# EAGLE design 2te8x24V_DC_In_4_v02 (EAGLE 5.04)
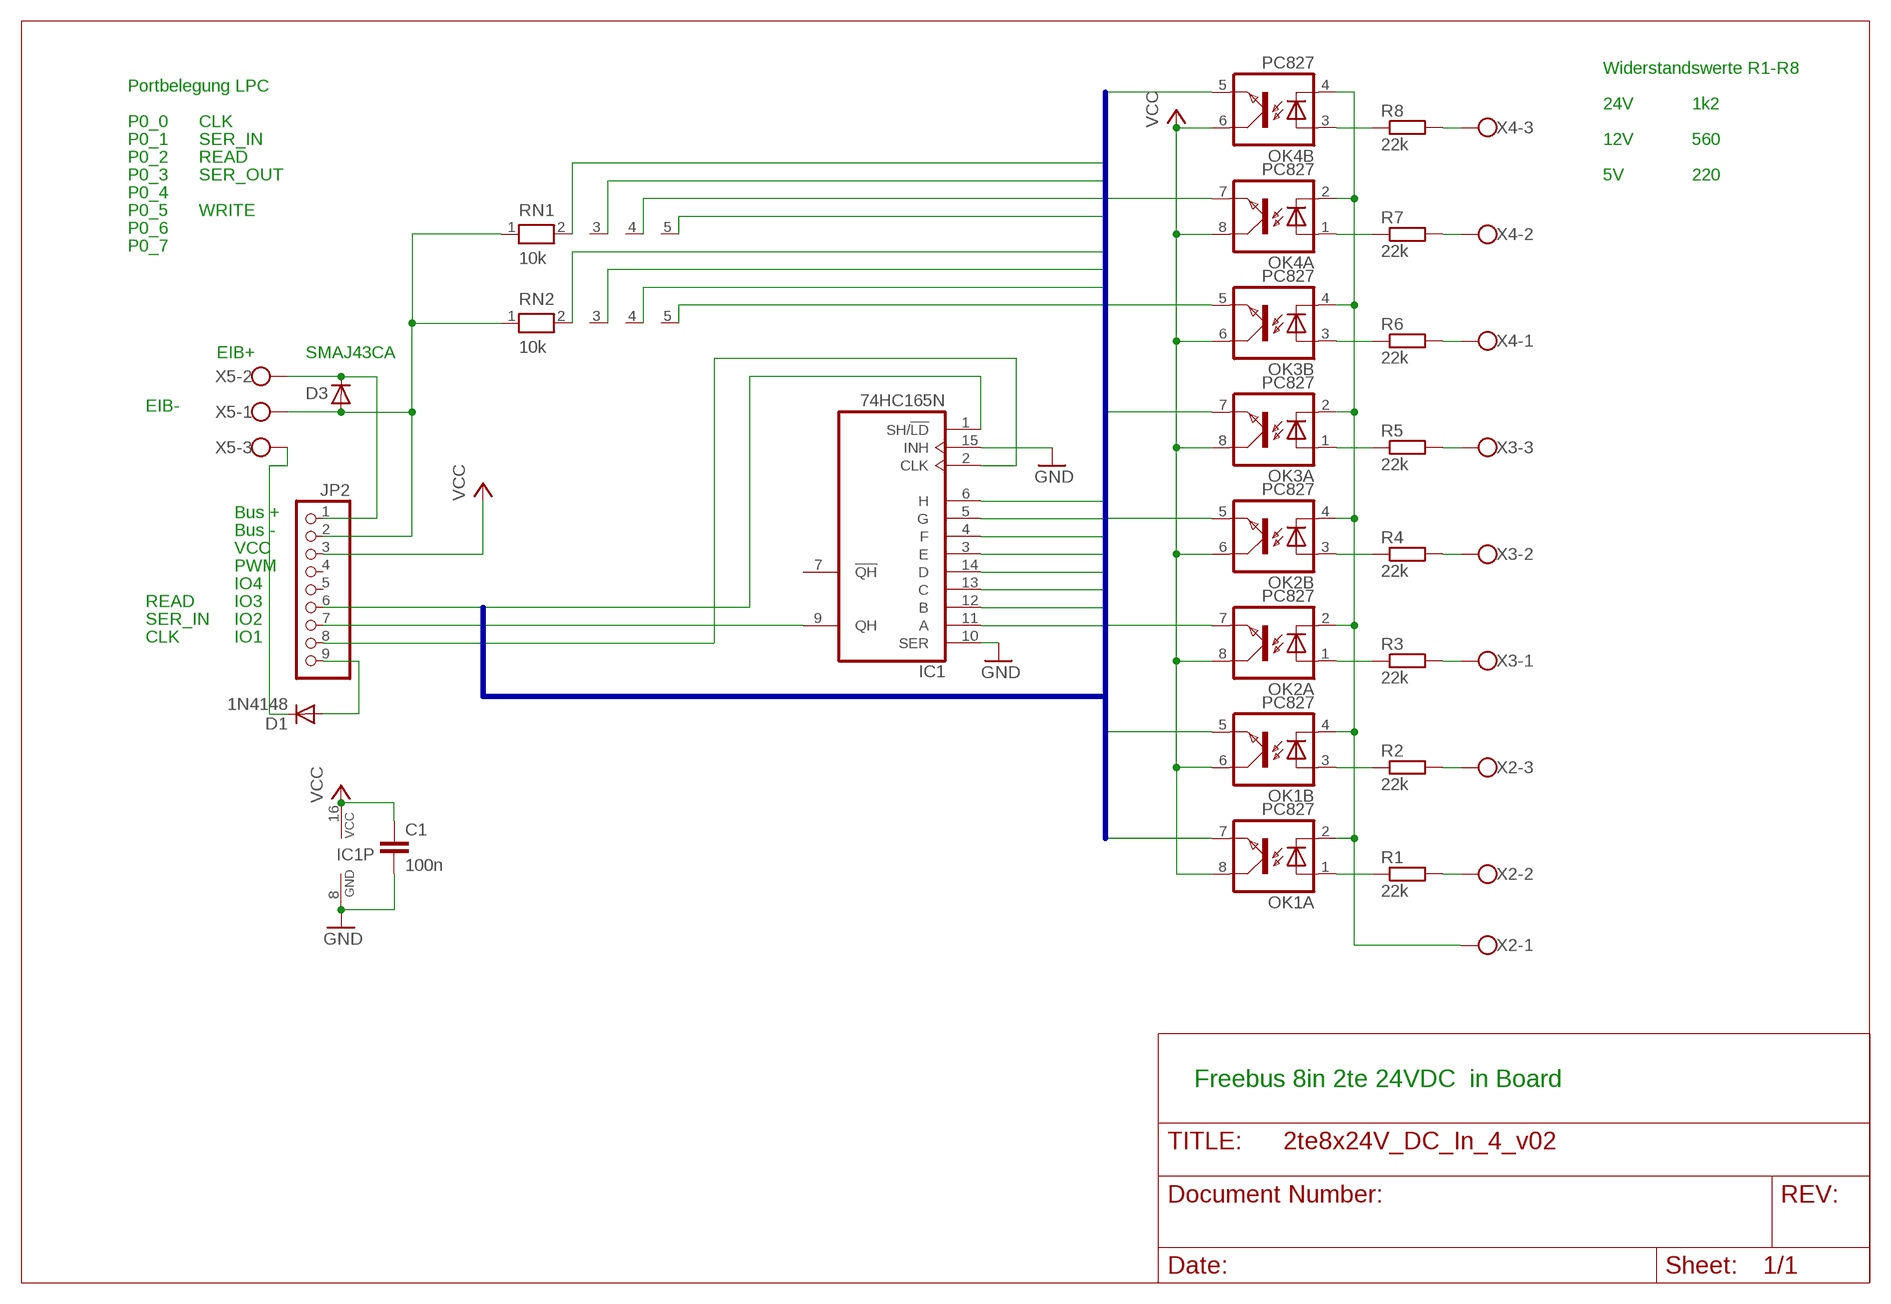
[diagram p0: schematic, sheet 1]

## Parts
C1  100n  C-EU050-024X044  [C050-024X044]
D1  1N4148  1N41481448V  [D-2.5]
D3  D-SMB  [SMB]
IC1  74HC165N  [DIL16]
JP2  PINHD-1X9  [1X09]
OK1  PC827  [DIL08]
OK2  PC827  [DIL08]
OK3  PC827  [DIL08]
OK4  PC827  [DIL08]
R1  22k  R-EU_0207/10  [0207/10]
R2  22k  R-EU_0207/10  [0207/10]
R3  22k  R-EU_0207/10  [0207/10]
R4  22k  R-EU_0207/10  [0207/10]
R5  22k  R-EU_0207/10  [0207/10]
R6  22k  R-EU_0207/10  [0207/10]
R7  22k  R-EU_0207/10  [0207/10]
R8  22k  R-EU_0207/10  [0207/10]
RN1  10k  RN04  [RN-5]
RN2  10k  RN04  [RN-5]
X2  W237-03P  [W237-133]
X3  W237-3E  [W237-3E]
X4  W237-3E  [W237-3E]
X5  W237-03P  [W237-133]

## Nets
E1: IC1.11(A) OK1.7(A:EMIT) RN2.2
E2: IC1.12(B) OK1.5(B:EMIT) RN2.3
E3: IC1.13(C) OK2.7(A:EMIT) RN2.4
E4: IC1.14(D) OK2.5(B:EMIT) RN2.5
E5: IC1.3(E) OK3.7(A:EMIT) RN1.5
E6: IC1.4(F) OK3.5(B:EMIT) RN1.4
E7: IC1.5(G) OK4.7(A:EMIT) RN1.3
E8: IC1.6(H) OK4.5(B:EMIT) RN1.2
EIB+: D3.1(C) JP2.1 X5.2
GND: C1.2 D3.2(A) IC1.8(GND) IC1.10(SER) IC1.15(INH) JP2.2 RN1.1 RN2.1 X5.1
GND24: OK1.2(A:C) OK1.4(B:C) OK2.2(A:C) OK2.4(B:C) OK3.2(A:C) OK3.4(B:C) OK4.2(A:C) OK4.4(B:C) X2.1
IO1: IC1.2(CLK) JP2.8
IO2: IC1.9(QH) JP2.7
IO3: IC1.1(SH/!LD) JP2.6
N$1: D1.C X5.3
N$2: OK1.1(A:A) R1.1
N$3: R1.2 X2.2
N$4: OK1.3(B:A) R2.1
N$5: R2.2 X2.3
N$6: OK2.1(A:A) R3.1
N$7: R3.2 X3.1
N$8: OK2.3(B:A) R4.1
N$9: R4.2 X3.2
N$10: OK3.1(A:A) R5.1
N$11: R5.2 X3.3
N$12: OK3.3(B:A) R6.1
N$13: R6.2 X4.1
N$14: OK4.1(A:A) R7.1
N$15: R7.2 X4.2
N$16: OK4.3(B:A) R8.1
N$17: R8.2 X4.3
N$18: D1.A JP2.9
VCC: C1.1 IC1.16(VCC) JP2.3 OK1.6(B:COL) OK1.8(A:COL) OK2.6(B:COL) OK2.8(A:COL) OK3.6(B:COL) OK3.8(A:COL) OK4.6(B:COL) OK4.8(A:COL)
Unconnected: IC1.7(!QH) JP2.4 JP2.5

## Buses
IO[1..8],E[1..8]

## Notes on the sheet
- Widerstandswerte R1-R8
- Portbelegung LPC
- 24V | 1k2
- P0_0 | CLK
- P0_1 | SER_IN | 12V | 560
- P0_2 | READ
- P0_3 | SER_OUT | 5V | 220
- P0_4
- P0_5 | WRITE
- P0_6
- P0_7
- EIB+ | SMAJ43CA
- EIB-
- Bus +
- Bus -
- VCC
- PWM
- IO4
- READ | IO3
- SER_IN | IO2
- CLK | IO1
- Freebus 8in 2te 24VDC  in Board

## Library data of the parts
C1 = rcl:C-EU: CAPACITOR, European symbol
D1 = diode:1N4148: DIODE high speed (Philips)
D3 = semicon-smd-ipc:D-: DIODE unfilled
IC1 = 74xx-eu:74*165: 8-bit parallel load SHIFT REGISTER
JP2 = pinhead:PINHD-1X9: PIN HEADER
OK1-OK4 = optocoupler:PC827: SHARP OPTO COUPLER
R1-R8 = rcl:R-EU_: RESISTOR, European symbol
RN1 RN2 = resistor-net:RN04: RESISTOR NETWORK
X2 X5 = con-wago-508:W237-03P: WAGO SREW CLAMP
X3 X4 = con-wago-508:W237-3E: WAGO SREW CLAMP

## Board
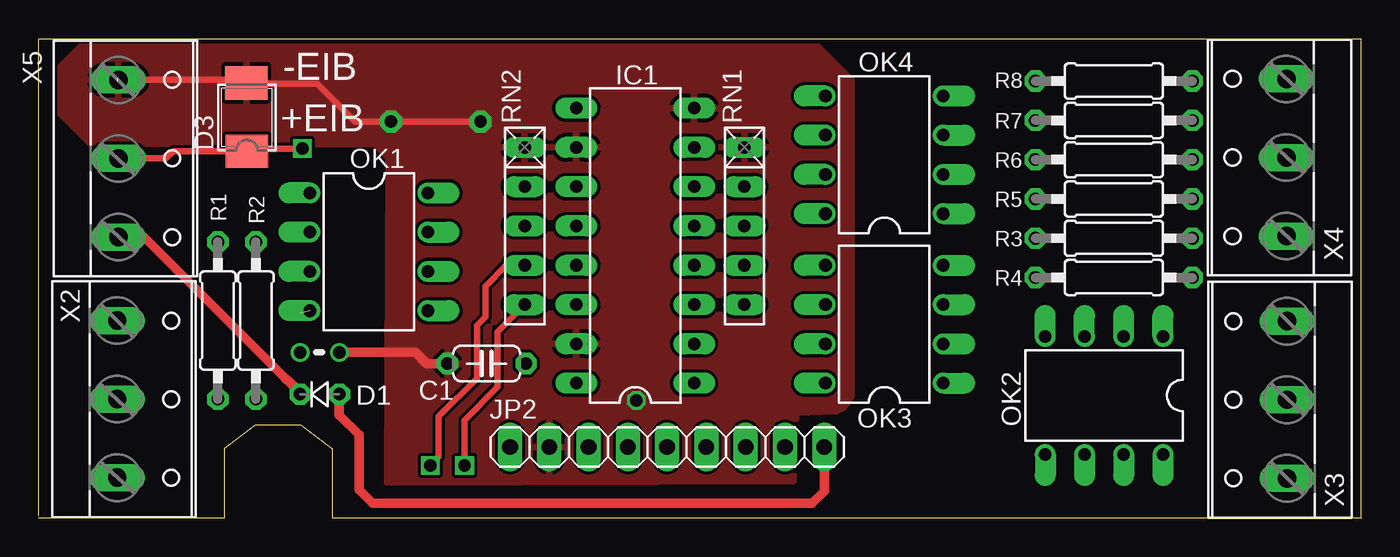
[diagram p1: board, top side]
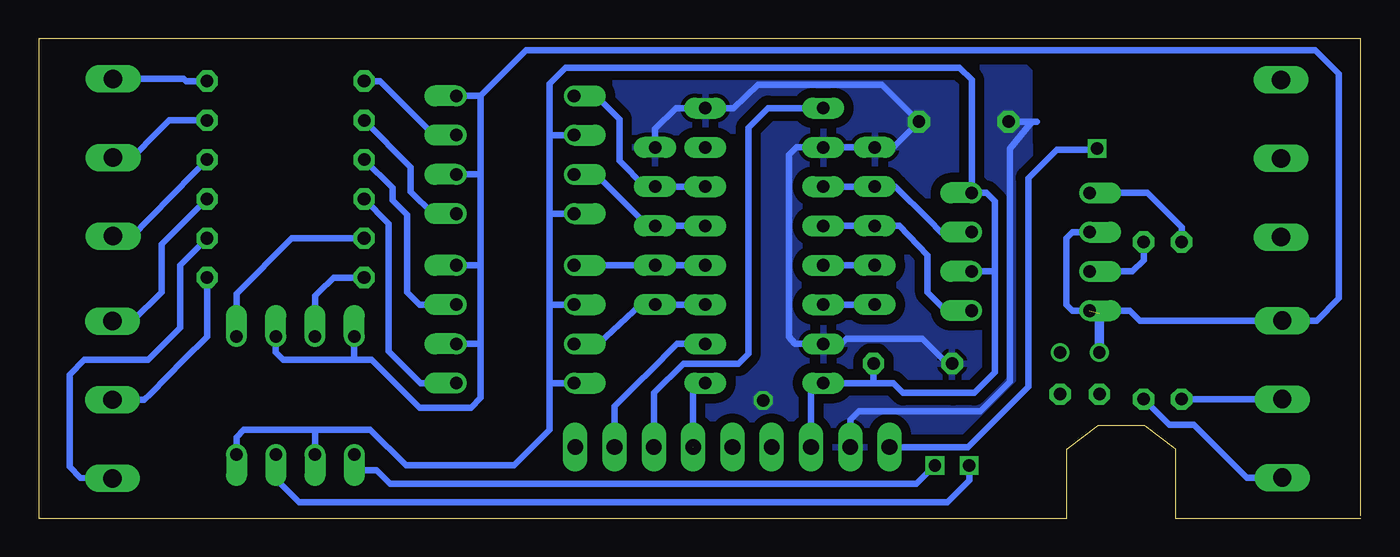
[diagram p2: board, bottom side, seen from below]

Size 85.5 x 31 mm. Coordinates in mm from the lower left corner, seen from the top.
Outline: 0.01,0.16 0.01,31 85.5,31 85.5,0 19,0 19,4.5 18.99,4.51 16.99,6.01 14.01,6.01 14.01,6 12,4.49 12,0 0,0
Copper layers (1*16): Top 0.035mm / dielectric 1.5mm / Bottom 0.035mm
Design rules "default_freebus *": minimum track width 10mil, minimum drill 24mil, track to track 8mil, track to pad 8mil, pad to pad 8mil, via to via 8mil, smd to smd 8mil, copper to edge 12mil, drill to drill 8mil, minimum pad ring 11mil, minimum via ring 8mil, stop-mask expansion 4mil, vias tented up to drill 0mil, thermal gap 10mil

### Footprints (pad centres in the part's own frame; a part is rotated, then mirrored left to right if it is on the bottom)
C050-024X044 = drill 0.813 octagon: 1 -2.54,0; 2 2.54,0
D-2.5 = drill 0.813 octagon: A 1.27,0; C -1.27,0
SMB = smd 2.159 x 2.743: 1 -2.311,-0.127; 2 2.108,-0.102
DIL16 = drill 0.813 long: 1 -8.89,-3.81; 2 -6.35,-3.81; 3 -3.81,-3.81; 4 -1.27,-3.81; 5 1.27,-3.81; 6 3.81,-3.81; 7 6.35,-3.81; 8 8.89,-3.81; 9 8.89,3.81; 10 6.35,3.81; 11 3.81,3.81; 12 1.27,3.81; 13 -1.27,3.81; 14 -3.81,3.81; 15 -6.35,3.81; 16 -8.89,3.81
1X09 = drill 1.016 long: 1 -10.16,0; 2 -7.62,0; 3 -5.08,0; 4 -2.54,0; 5 0,0; 6 2.54,0; 7 5.08,0; 8 7.62,0; 9 10.16,0
DIL08 = drill 0.813 offset: 1 -3.81,-3.81; 2 -1.27,-3.81; 3 1.27,-3.81; 4 3.81,-3.81; 5 3.81,3.81; 6 1.27,3.81; 7 -1.27,3.81; 8 -3.81,3.81
0207/10 = drill 0.813 octagon: 1 -5.08,0; 2 5.08,0
RN-5 = drill 0.813 long: 1 -5.08,0; 2 -2.54,0; 3 0,0; 4 2.54,0; 5 5.08,0
W237-133 = drill 1.194 long: 1 -5.08,-0.635; 2 0,-0.635; 3 5.08,-0.635
W237-3E = drill 1.194 long: 1 -5.08,-0.635; 2 0,-0.635; 3 5.08,-0.635

### Placement (x,y rotation side)
C1  28.97,10 180 top
D1  18.18,8.02 0 top
D3  13.33,26.04 90 top
IC1  38.58,17.62 90 top
JP2  40.64,4.61 0 top
OK1  21.35,17.23 270 top
OK2  68.9,7.94 180 top
OK3  54.69,12.54 90 top
OK4  54.69,23.5 90 top
R1  11.59,12.78 270 top
R2  14.05,12.78 270 top
R3  69.53,18.1 0 top
R4  69.53,15.56 0 top
R5  69.53,20.64 0 top
R6  69.53,23.18 0 top
R7  69.53,25.72 0 top
R8  69.53,28.26 0 top
RN1  45.64,18.89 270 top
RN2  31.43,18.89 270 top
X2  5.71,7.7 270 top
X3  80.1,7.66 90 top
X4  80.05,23.32 90 top
X5  5.79,23.26 270 top

### Tracks (layer width: path | path; a pad name or v marks a point on that pad's centre or on a via)
E1
  Bottom 0.406: IC1.11 RN2.2 30.08,21.43 27.94,19.29 27.14,18.5 OK1.7
E2
  Bottom 0.406: IC1.12 RN2.3 29.84,18.89 28.02,16.99 28.02,14.61 26.83,13.42 OK1.5
E3  (via drill 0.8)
  Top 0.406: v25.32,3.41 25.88,3.97 25.88,6.59 28.34,9.05 28.34,12.46 28.89,13.02 28.89,15 30.24,16.35 RN2.4
  Bottom 0.406: RN2.4 IC1.13 | OK2.7 70.17,2.54 68.66,1.03 26.75,1.03 25.32,2.46 v25.32,3.41
E4  (via drill 0.8)
  Top 0.406: v27.54,3.41 27.54,6.35 29.68,8.5 29.68,12.07 RN2.5
  Bottom 0.406: RN2.5 IC1.14 | OK2.5 65.09,3.1 63.66,3.1 62.78,2.22 28.73,2.22 v27.54,3.41
E5
  Bottom 0.406: IC1.3 RN1.5 46.59,13.81 49.29,11.27 OK3.7
E6
  Bottom 0.406: IC1.4 RN1.4 46.28,16.35 47.86,16.35 48.26,16.35 48.58,16.35 OK3.5
E7
  Bottom 0.406: IC1.5 RN1.3 46.12,18.89 47.94,20.72 49.45,22.23 OK4.7
E8
  Bottom 0.406: IC1.6 RN1.2 46.28,21.43 47.94,23.1 47.94,25.8 49.45,27.31 OK4.5
EIB+  (via drill 0.8)
  Top 0.406: v17.06,23.89 13.63,23.89 D3.1 8.72,23.73 8.25,23.26 X5.2
  Bottom 0.406: v17.06,23.89 17.13,23.83 19.67,23.83 21.51,21.99 21.51,8.5 25.4,4.61 30.16,4.61 JP2.1 | JP2.1
GND  (via drill 0.8, 0.8 pad 1.42)
  Top 0.406: v28.57,25.64 v22.78,25.64 20.48,25.64 18.02,28.1 13.48,28.1 D3.2 13.24,28.34 X5.1
  Top 0.61: v19.45,10.72 24.37,10.72 25.08,10 26.35,10
  Bottom 0.406: RN1.1 45.64,25.16 44.29,26.51 IC1.8 40.56,26.51 38.97,28.02 30.95,28.02 v28.57,25.64 | IC1.10 RN2.1 30.24,23.97 v28.57,25.64 | IC1.10 36.51,23.97 | 36.51,23.97 36.99,23.5 36.99,15.64 36.99,14.21 36.99,11.75 36.59,11.27 IC1.15 33.58,11.27 33.26,11.59 28.34,11.59 26.75,10 C1.2 | 36.51,23.97 IC1.10 | JP2.2 33.02,6.35 32.46,6.91 24.61,6.91 22.7,8.81 22.7,23.89 21.27,25.64 20.95,25.64 v22.78,25.64 | JP2.2 | v28.57,25.64
  other vias: 38.65,7.62
  pour Bottom (isolate 0.61): 21.43,28.89 21.67,29.13 52.47,29.13 52.94,28.66 52.94,0.95 52.86,0.88 21.35,0.88
  pour Top: 22.54,2.3 22.62,23.26 21.75,24.13 3.33,24.21 1.43,26.12 1.43,29.21 2.78,30.56 50.32,30.56 52.55,28.34 52.55,7.86 52.47,7.7 52.07,7.15 51.59,6.91 48.97,6.83 48.81,2.38
GND24  (via drill 0.8)  (1 unrouted)
  Bottom 0.406: OK1.2 18.65,18.5 19.05,18.1 19.05,13.81 18.65,13.42 OK1.4 14.92,13.42 14.29,12.78 X2.1 2.86,12.78 1.43,14.21 1.43,28.74 2.94,30.24 46.83,30.24 53.97,30.24 56.91,27.31 | OK2.2 70.17,11.59 70.17,10.72 69.69,10.24 65.09,10.24 | 65.09,10.24 63.98,10.24 60.88,7.15 57.55,7.15 56.91,7.78 56.91,11.04 56.91,11.27 | 65.09,10.24 OK2.4 | 56.91,11.27 OK3.2 | 56.91,16.35 OK3.4 | 56.91,16.35 56.91,11.27 | 56.91,22.23 OK4.2 | 56.91,22.23 56.91,16.35 | OK4.4 57.15,27.31 56.91,27.31 | 56.91,27.31 56.91,22.23
  Bottom 0.61: v16.91,10.72 16.91,13.26
IO1
  Bottom 0.406: JP2.8 48.26,7.22 46.67,8.81 46.04,9.45 44.21,11.27 IC1.2 | JP2.8
IO2
  Bottom 0.406: JP2.7 45.72,8.1 43.81,10 40.24,10 39.61,10.64 39.61,20.56 39.61,22.94 39.61,25.24 38.34,26.51 IC1.9 | JP2.7
IO3  (1 unrouted)
  Bottom 0.406: IC1.1 43.18,8.73 JP2.6
N$1
  Top 0.61: X5.3 6.82,18.18 15.95,9.05 16.98,8.1 D1.C
N$2
  Bottom 0.406: R1.1 11.59,18.81 13.81,21.04 OK1.1
N$3
  Bottom 0.406: X2.2 5.4,7.7 R1.2
N$4
  Bottom 0.406: R2.1 14.05,16.67 14.76,15.96 OK1.3 | OK1.3
N$5
  Bottom 0.406: X2.3 7.38,2.62 10.79,6.03 12.38,6.03 R2.2
N$6
  Bottom 0.406: R3.1 69.13,18.1 72.71,14.53 OK2.1
N$7
  Bottom 0.406: X3.1 82.83,2.62 83.5,3.34 83.5,9.29 82.55,10.24 78.42,10.24 76.36,12.31 76.36,16.35 R3.2
N$8
  Bottom 0.406: R4.1 66.04,15.56 66.44,15.56 66.59,15.4 67.23,14.77 67.63,14.37 OK2.3
N$9
  Bottom 0.406: X3.2 78.66,7.66 78.26,8.06 76.12,10.24 74.61,11.75 74.61,12.78 74.61,12.86 R4.2
N$10
  Bottom 0.406: R5.1 | R5.1 62.86,19.05 62.86,10.8 60.8,8.73 OK3.1
N$11
  Bottom 0.406: X3.3 79.45,12.74 77.55,14.61 77.55,17.7 75.88,19.37 R5.2 | R5.2
N$12
  Bottom 0.406: R6.1 62.63,21.35 62.63,20.56 61.67,19.61 61.67,14.61 60.88,13.81 OK3.3
N$13
  Bottom 0.406: X4.1 79.45,18.24 78.34,19.37 78.26,19.45 75.48,22.31 R6.2 | R6.2
N$14
  Bottom 0.406: R7.1 61.44,22.7 61.44,21.12 60.01,19.69 58.58,19.69 OK4.1 | OK4.1
N$15
  Bottom 0.406: X4.2 79.45,23.32 77.79,25 77.71,25.08 77.07,25.72 R7.2
N$16
  Bottom 0.406: R8.1 63.42,28.26 61.52,26.36 59.93,24.77 58.58,24.77 OK4.3
N$17
  Bottom 0.406: X4.3 76.12,28.4 75.96,28.26 R8.2
N$18
  Top 0.61: D1.A 19.45,6.67 20.72,5.4 20.72,1.83 21.59,0.95 50.01,0.95 50.8,1.75 JP2.9
VCC
  Bottom 0.406: OK1.8 24.21,21.04 23.65,20.48 23.65,15.32 23.65,15.96 | 23.65,15.96 OK1.6 | 23.65,15.96 23.65,10 23.65,9.45 25,8.1 26.35,8.1 29.61,8.1 30.24,8.73 31.51,8.73 | JP2.3 35.56,8.73 IC1.16 | JP2.3 | 67.63,5.72 64.05,5.72 61.75,3.41 54.77,3.41 52.47,5.72 52.47,8.73 | 52.47,8.73 OK3.8 | OK2.8 72.71,5.24 72.23,5.72 67.63,5.72 | 52.47,13.81 OK3.6 | 52.47,19.69 OK4.8 | 52.47,24.77 OK4.6 | 52.47,13.81 52.47,8.73 | 52.47,19.69 52.47,13.81 | 52.47,24.77 52.47,19.69 | 67.63,5.72 OK2.6 | OK1.8 26.27,21.04 | 52.47,24.77 52.47,24.61 52.47,27.62 52.47,28.1 51.43,29.13 25.95,29.13 25.16,28.34 OK1.8 | IC1.16 | IC1.16 | 31.51,8.73 IC1.16 | 31.51,8.73 C1.1

### Text on the board
tPlace: -EIB | +EIB